# EAGLE design DMS fullbridge (EAGLE 9.6.2)
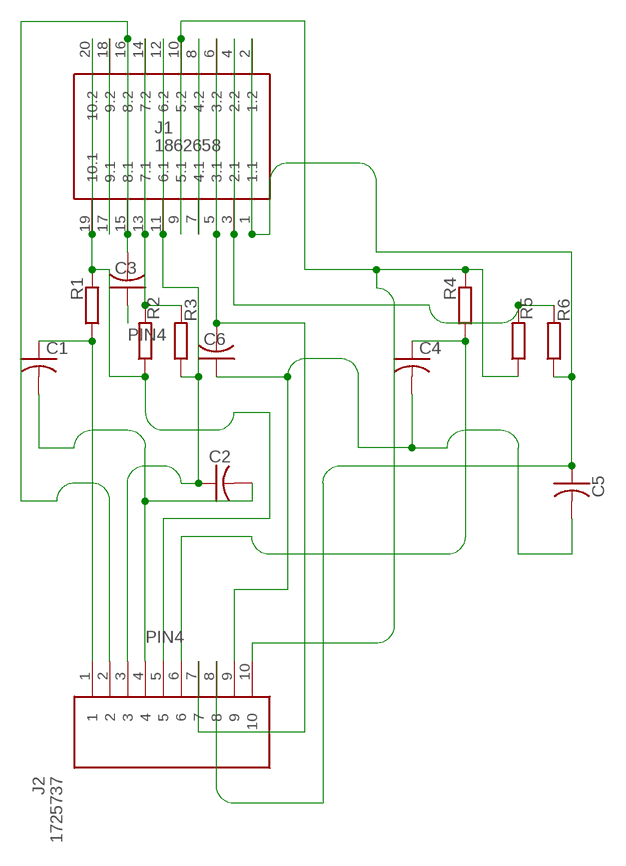
[diagram p0: schematic, sheet 1]

## Parts
C1  C-US050-030X075  [C050-030X075]
C2  C-US050-030X075  [C050-030X075]
C3  C-US050-030X075  [C050-030X075]
C4  C-US050-030X075  [C050-030X075]
C5  C-US050-030X075  [C050-030X075]
C6  C-US050-030X075  [C050-030X075]
J1  1862658  [1862658]
J2  1725737  [1725737]
R1  R-EU_0204/7  [0204/7]
R2  R-EU_0204/7  [0204/7]
R3  R-EU_0204/7  [0204/7]
R4  R-EU_0204/7  [0204/7]
R5  R-EU_0204/7  [0204/7]
R6  R-EU_0204/7  [0204/7]

## Nets
3: C2.1 J1.11(6.1) J1.12(6.2) J2.3 R3.1
9: C4.2 C5.2 C6.1 J2.9
AIN1.1: C6.2 J1.5(3.1) J1.6(3.2) J2.7
AIN1.3: C3.2 J1.15(8.1) J1.16(8.2) J2.2
N$1: J1.3(2.1) J1.4(2.2) R5.2 R6.2
N$2: J1.13(7.1) J1.14(7.2) R2.2 R3.2
N$5: J1.17(9.1) J1.18(9.2)
N$6: J1.7(4.1) J1.8(4.2)
ONE: C1.1 C4.1 J2.1 J2.6 R1.1 R4.1
PIN4: C1.2 C2.2 C3.1 J2.4
PIN8: C5.1 J1.1(1.1) J1.2(1.2) J2.8 R6.1
UF.1: J1.19(10.1) J1.20(10.2) J2.5 R1.2 R2.1
UF.2: J1.9(5.1) J1.10(5.2) J2.10 R4.2 R5.1

## Library data of the parts
C1-C6 = adafruit:C-US: CAPACITOR, American symbol
J1 = 1862658:1862658: PCB header, nominal cross section: 1.5 mm?, color: green, nominal current: 8 A, rated voltage (III/2): 160 V, contact surface: Tin, type of contact: Female connector, Number of potentials: 10, Number of rows: 1, Number of positions per row: 10, number of connections: 10, product range: IMC 1,5/..-G, pitch: 3.81 mm, mounting: Wave soldering, pin layout: Linear pinning, solder pin [P]: 3.4 mm, Stecksystem: MINI COMBICON, Locking: without, type of packaging: packed in cardboard Source: Datasheet <http://www.phoenixcontact.com/gb/produkte/1862658>; DESCRIPTION: PCB header, nominal cross section: 1.5 mm?, color: green, nominal current: 8 A, rated voltage (III/2): 160 V, contact surface: Tin, type of contact: Female connector, Number of potentials: 10, Number of rows: 1, Number of positions per row: 10, number of connections: 10, product range: IMC 1,5/..-G, pitch: 3.81 mm, mounting: Wave soldering, pin layout: Linear pinning, solder pin [P]: 3.4 mm, Stecksystem: MINI COMBICON, Locking: without, type of packaging: packed in cardboard; HEIGHT: 6.85mm; MANUFACTURER_NAME: Phoenix Contact; MANUFACTURER_PART_NUMBER: 1862658; MOUSER_PART_NUMBER: 651-1862658; MOUSER_PRICE-STOCK: https://www.mouser.co.uk/ProductDetail/Phoenix-Contact/1862658?qs=Hp4IEBVVqKLDX0DncvrTIQ%3D%3D
J2 = 1725737:1725737: Fixed Terminal Blocks 10P 2.54mm 90DEG Source: Datasheet <https://www.phoenixcontact.com/online/portal/us/?uri=pxc-oc-itemdetail:pid=1725737&library=usen&pcck=P-11-01-05&tab=1&selectedCategory=ALL>; ARROW_PART_NUMBER: 1725737; ARROW_PRICE-STOCK: https://www.arrow.com/en/products/1725737/phoenix-contact?region=nac; DESCRIPTION: Fixed Terminal Blocks 10P 2.54mm 90DEG; HEIGHT: 8.65mm; MANUFACTURER_NAME: Phoenix Contact; MANUFACTURER_PART_NUMBER: 1725737; MOUSER_PART_NUMBER: 651-1725737; MOUSER_PRICE-STOCK: https://www.mouser.co.uk/ProductDetail/Phoenix-Contact/1725737?qs=W3wJikR1%252BS4TtzjqDk79Bg%3D%3D
R1-R6 = rcl:R-EU_: RESISTOR, European symbol; SPICEPREFIX: R

## Board
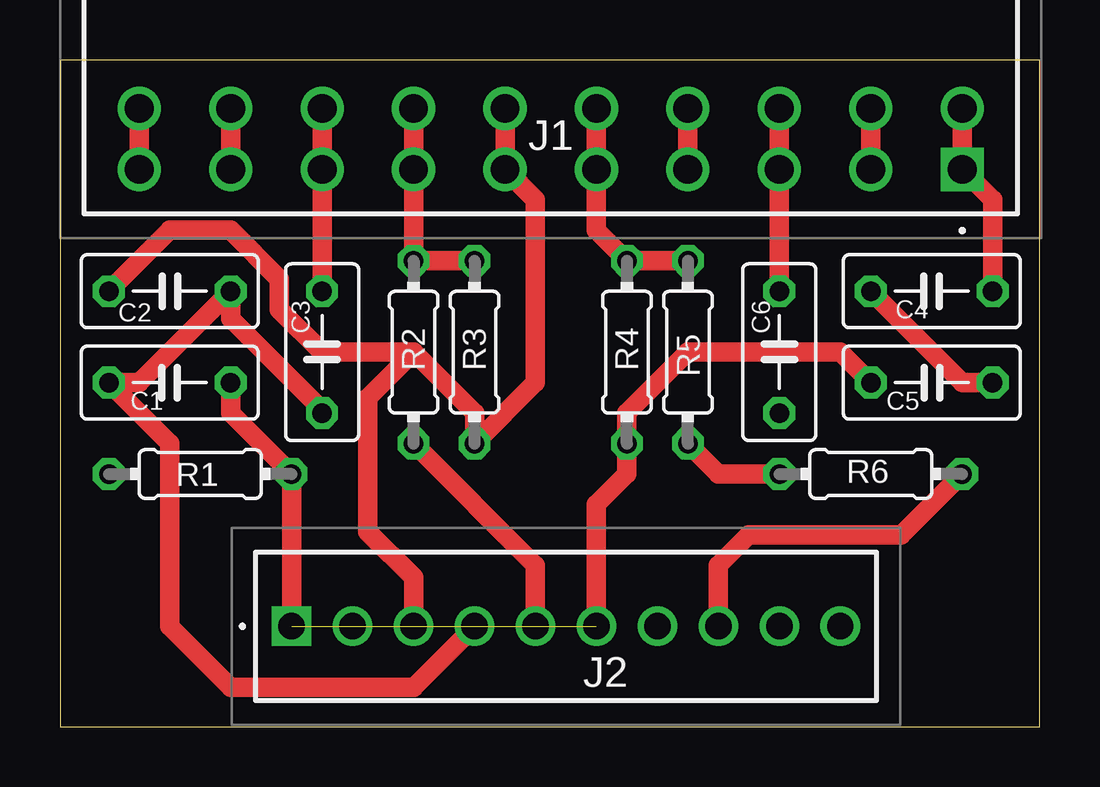
[diagram p1: board, top side]
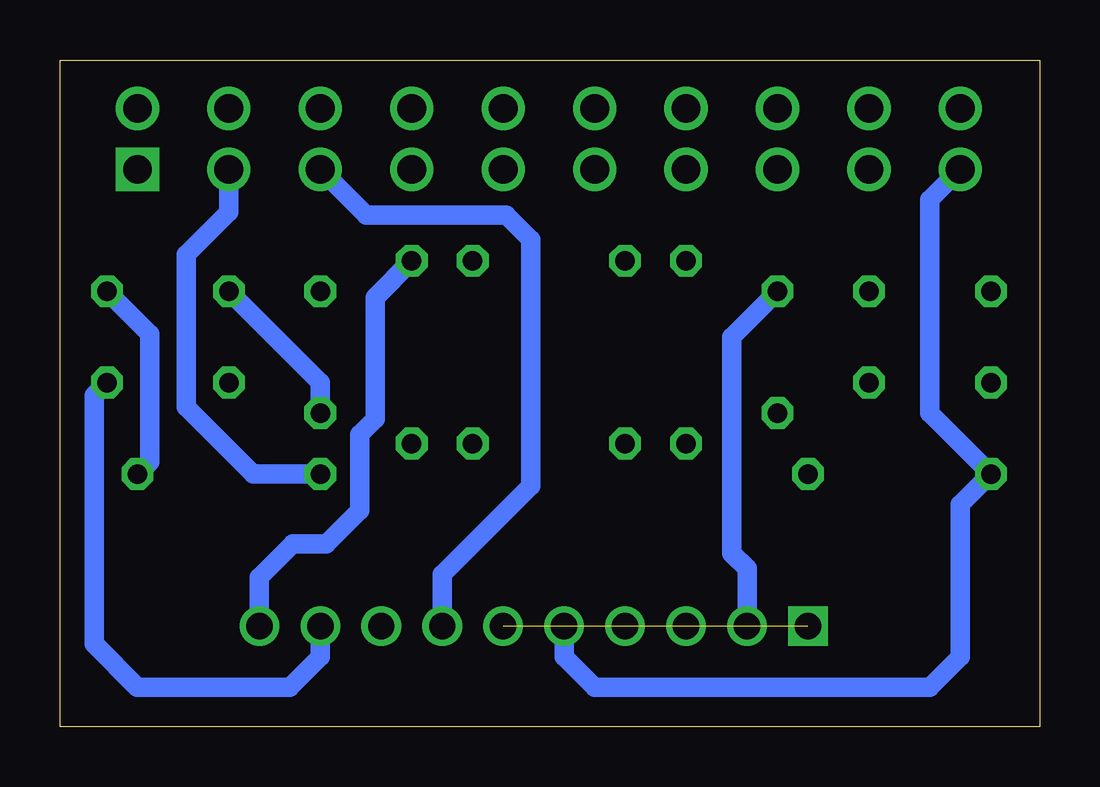
[diagram p2: board, bottom side, seen from below]

Size 40.82 x 27.8 mm. Coordinates in mm from the lower left corner, seen from the top.
Outline: 0,0 40.82,0 40.82,27.8 0,27.8 0,0
Copper layers (1*16): Top 0.035mm / dielectric 1.5mm / Bottom 0.035mm
Design rules "default": minimum track width 6mil, minimum drill 0.35mm, track to track 6mil, track to pad 6mil, pad to pad 6mil, via to via 6mil, smd to smd 6mil, copper to edge 40mil, drill to drill 6mil, minimum pad ring 10mil, minimum via ring 8mil, stop-mask expansion 4mil, vias tented up to drill 0mil, thermal gap 10mil

### Footprints (pad centres in the part's own frame; a part is rotated, then mirrored left to right if it is on the bottom)
C050-030X075 = drill 0.813 octagon: 1 -2.54,0; 2 2.54,0
1862658 = drill 1.2 pad 1.8 square: 1 0,0 | drill 1.2 pad 1.8: 2 0,-2.54; 3 3.81,0; 4 3.81,-2.54; 5 7.62,0; 6 7.62,-2.54; 7 11.43,0; 8 11.43,-2.54; 9 15.24,0; 10 15.24,-2.54; 11 19.05,0; 12 19.05,-2.54; 13 22.86,0; 14 22.86,-2.54; 15 26.67,0; 16 26.67,-2.54; 17 30.48,0; 18 30.48,-2.54; 19 34.29,0; 20 34.29,-2.54
1725737 = drill 1.1 pad 1.65 square: 1 0,0 | drill 1.1 pad 1.65: 2 2.54,0; 3 5.08,0; 4 7.62,0; 5 10.16,0; 6 12.7,0; 7 15.24,0; 8 17.78,0; 9 20.32,0; 10 22.86,0
0204/7 = drill 0.813 octagon: 1 -3.81,0; 2 3.81,0

### Placement (x,y rotation side)
C1  4.57,14.35 180 top
C2  4.57,18.16 0 top
C3  10.92,15.62 90 top
C4  36.32,14.35 0 top
C5  36.32,18.16 180 top
C6  29.97,15.62 90 top
J1  37.59,23.24 180 top
J2  9.65,4.19 0 top
R1  5.84,10.54 180 top
R2  14.73,15.62 90 top
R3  17.27,15.62 90 top
R4  23.62,15.62 90 top
R5  26.16,15.62 270 top
R6  33.78,10.54 180 top

### Tracks (layer width: path | path; a pad name or v marks a point on that pad's centre or on a via)
3
  Top 0.813: J1.12 J1.11 19.81,21.97 19.81,14.35 R3.1 17.27,13.08 14.73,15.62 | C2.1 4.57,20.7 7.11,20.7 9.14,18.67 9.14,17.4 10.92,15.62 14.73,15.62 | J2.3 14.73,6.22 12.83,8.13 12.83,13.72 14.73,15.62
9
  Top 0.813: C4.2 37.59,14.35 C5.2
  Bottom 0.813: C5.2 29.97,14.35 C6.1 | C4.2 39.4,13.82 39.4,3.45 37.59,1.65 31.24,1.65 29.97,2.92 J2.9
AIN1.1
  Top 0.813: J1.6 J1.5 C6.2
  Bottom 0.813: J1.5 28.07,21.34 22.23,21.34 21.21,20.32 21.21,10.03 24.89,6.35 J2.7
AIN1.3
  Top 0.813: J1.16 J1.15 C3.2
  Bottom 0.813: C3.2 12.83,16.26 12.83,7.24 12.19,6.6 J2.2
N$1
  Top 0.813: J1.4 J1.3 | R6.2 27.43,10.54 R5.2
  Bottom 0.813: J1.3 33.78,21.46 35.56,19.68 35.56,13.34 32.77,10.54 R6.2
N$2
  Top 0.813: J1.14 J1.13 R2.2 R3.2
N$5
  Top 0.813: J1.18 J1.17
N$6
  Top 0.813: J1.8 J1.7
ONE  (1 unrouted)
  Top 0.813: J2.6 22.35,9.27 23.62,10.54 R4.1 23.62,13.08 26.16,15.62 32.51,15.62 C4.1 | C1.1 7.11,13.08 R1.1 J2.1
PIN4
  Top 0.813: J2.4 14.73,1.65 7.11,1.65 4.57,4.19 4.57,11.81 C1.2 3.3,14.35 C2.2 7.11,17.02 10.92,13.21 C3.1
PIN8
  Top 0.813: J1.2 J1.1 38.86,21.97 C5.1 | R6.1 35.05,8 28.7,8 27.43,6.73 J2.8
  Bottom 0.813: R6.1 37.08,11.05 37.08,16.38 C5.1
UF.1
  Top 0.813: J1.20 J1.19 | R2.1 19.81,6.73 J2.5
  Bottom 0.813: J1.19 4.57,21.97 4.57,13.08 R1.2 3.3,9.27 3.3,2.92 4.57,1.65 18.54,1.65 19.81,2.92 J2.5
UF.2
  Top 0.813: J1.10 J1.9 22.35,20.7 R4.2 R5.1
  Bottom 0.813: R5.1 27.69,17.91 27.69,12.83 28.32,12.19 28.32,9.02 29.72,7.62 31.12,7.62 32.51,6.22 J2.10

### Text on the board
tPlace: /Volumes/Files/PROJEKTE/DMS Vollbrücke Terra/v1.1/Logo BMP/NEUbmp.bmp